# Altium schematic sheet CSP.SchDoc
size A4
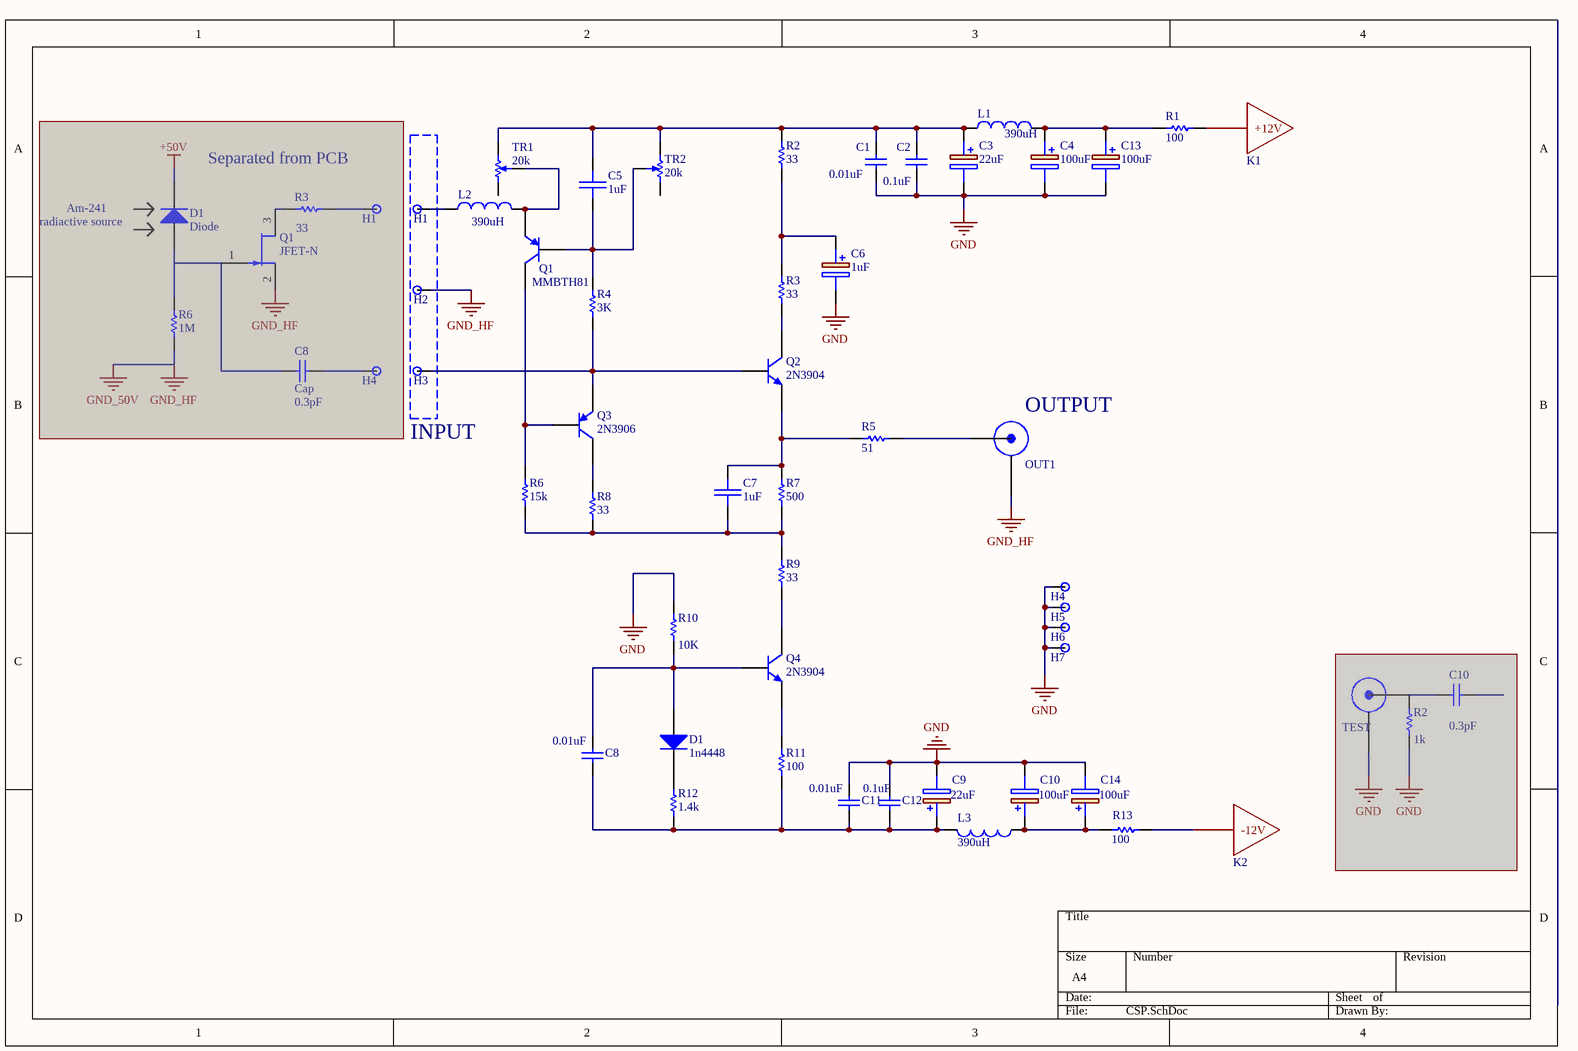
[diagram p0: CSP.SchDoc]

## Parts
(Parts that share a designator on the sheet are numbered #1, #2 ... from top to bottom, then left to right.)
C1  0.01uF  [SMD-0805-C]
C2  0.1uF  [SMD-0805-C]
C3  22uF  [CAPAE660X550N]
C4  100uF  [CAPAE660X800N]
C5  1uF  [CAPC3225X15L]
C6  1uF  [CAPAE430X550N]
C7  1uF  [CAPC3225X15L]
C8#1  Cap  value 0.3pF  [0603]  (masked out: inside a compile mask, not in the netlist)
C8#2  0.01uF  [SMD-0805-C]
C9  22uF  [CAPAE660X550N]
C10#1  value 0.3pF  [0603]  (hidden comment: Cap)  (masked out: inside a compile mask, not in the netlist)
C10#2  100uF  [CAPAE660X800N]
C11  0.01uF  [SMD-0805-C]
C12  0.1uF  [SMD-0805-C]
C13  100uF  [CAPAE660X800N]
C14  100uF  [CAPAE660X800N]
D1#1  Diode  [SMC]  (masked out: inside a compile mask, not in the netlist)
D1#2  1n4448  [SODFL350X110-2N]
H1#1  PAD  [PAD]  (value not drawn)  (no BOM)  (masked out: inside a compile mask, not in the netlist)
H1#2  PAD  [PAD]  (value not drawn)  (no BOM)
H2  PAD  [PAD]  (value not drawn)  (no BOM)
H3  PAD  [PAD]  (value not drawn)  (no BOM)
H4#1  PAD  [PAD]  (value not drawn)  (no BOM)  (masked out: inside a compile mask, not in the netlist)
H4#2  PAD  [PAD]  (value not drawn)  (no BOM)
H5  PAD  [PAD]  (value not drawn)  (no BOM)
H6  PAD  [PAD]  (value not drawn)  (no BOM)
H7  PAD  [PAD]  (value not drawn)  (no BOM)
K1  +12V  [PAD]  (value not drawn)  (no BOM)
K2  -12V  [PAD]  (value not drawn)  (no BOM)
L1  390uH  [INDC3225X270N]
L2  390uH  [INDC3225X270N]
L3  390uH  [INDC3225X270N]
OUT1  OUTPUT  [IN/OUT]  (value not drawn)  (no BOM)
Q1#1  JFET-N  [SOT23_M]  (masked out: inside a compile mask, not in the netlist)
Q1#2  MMBTH81  [SOT23-3P95_240X110L53X44N]
Q2  2N3904  [SOT23-3P95_240X110L53X44N]
Q3  2N3906  [SOT23-3P95_240X110L53X44N]
Q4  2N3904  [SOT23-3P95_240X110L53X44N]
R1  100  [SMD-0805-RES]
R2#1  33  [SMD-0805-RES]
R2#2  value 1k  [SMD-0805-RES]  (hidden comment: Res1)  (masked out: inside a compile mask, not in the netlist)
R3#1  value 33  [SMD-0805-RES]  (masked out: inside a compile mask, not in the netlist)
R3#2  33  [SMD-0805-RES]
R4  3K  [SMD-0805-RES]
R5  51  [SMD-0805-RES]
R6#1  value 1M  [SMD-0805-RES]  (masked out: inside a compile mask, not in the netlist)
R6#2  15k  [SMD-0805-RES]
R7  500  [SMD-0805-RES]
R8  33  [SMD-0805-RES]
R9  33  [SMD-0805-RES]
R10  10K  [SMD-0805-RES]
R11  100  [SMD-0805-RES]
R12  1.4k  [SMD-0805-RES]
R13  100  [SMD-0805-RES]
TEST  INPUT  [IN/OUT]  (value not drawn)  (masked out: inside a compile mask, not in the netlist)
TR1  20k  [POT4MM-2]
TR2  20k  [POT4MM-2]

## Blocks framed on the sheet
Separated from PCB: C8#1 D1#1 H1#1 H4#1 Q1#1 R3#1 R6#1

## Nets
GND: C1.1 C2.1 C3.2(-) C4.2(-) C6.2(-) C9.2(-) C10#2.2(-) C11.1 C12.1 C13.2(-) C14.2(-) H4#2.1 H5.1 H6.1 H7.1 R10.2
GND_HF: H2.1 OUT1.2(GND)
NetC1_2: C1.2 C2.2 C3.1(+) C5.2(-) L1.1 R2#1.2 TR1.CW(+) TR2.CCW(-)
NetC4_1: C4.1(+) C13.1(+) L1.2 R1.2
NetC5_1: C5.1(+) Q1#2.3(B) R4.2 TR2.W
NetC6_1: C6.1(+) R2#1.1 R3#2.2
NetC7_1: C7.1(+) R6#2.1 R7.1 R8.1 R9.2
NetC7_2: C7.2(-) Q2.2(E) R5.2 R7.2
NetC8#2_1: C8#2.1 D1#2.A Q4.3(B) R10.1
NetC8#2_2: C8#2.2 C9.1(+) C11.2 C12.2 L3.2 R11.1 R12.1
NetC10#2_1: C10#2.1(+) C14.1(+) L3.1 R13.2
NetD1#2_C: D1#2.C R12.2
NetH1#2_1: H1#2.1 L2.1
NetH3_1: H3.1 Q2.3(B) Q3.2(E) R4.1
NetK1_1: K1.1(+12V) R1.1
NetK2_1: K2.1(-12V) R13.1
NetL2_2: L2.2 Q1#2.2(E) TR1.W
NetOUT1_1: OUT1.1(IN) R5.1
NetQ1#2_1: Q1#2.1(C) Q3.3(B) R6#2.2
NetQ2_1: Q2.1(C) R3#2.1
NetQ3_1: Q3.1(C) R8.2
NetQ4_1: Q4.1(C) R9.1
NetQ4_2: Q4.2(E) R11.2

Not connected (* = marked no-connect by the designer): TR1 CCW(-); TR2 CW(+)

## Notes on the sheet
- (near D1#1) radiactive source
- Am-241
- INPUT
- (near OUT1) OUTPUT

## Library data of the parts
C1 C2 C8#1 C8#2 C10#1 C11 C12 = Cap: Capacitor; Published: 8-Jun-2000; LatestRevisionDate: 17-Jul-2002; LatestRevisionNote: Re-released for DXP Platform.; PackageReference: RAD-0.3; Publisher: Altium Limited; PackageDescription: Radial Cap, Thru-Hole; 2 Leads; 0.3 in Pin Spacing
  C1 C8#2 C11: Value: 0.01uF; LCSC Part #: C1710
  C2 C12: Value: 0.1uF; LCSC Part #: C49678
C3 C9 = TYEH1V226F55MTR: 22uF 35V, Capacitor Polarised; Part number: TYEH1V226F55MTR; Value: 22uF; Dimension: 6.3x5.3mm; Voltage: 35V; LCSC Part #: C249771
C4 C10#2 C13 C14 = EEEFK1E101P: 100uF 25V, cap polarised; Part number: EEEFK1E101P; Dimensions: 8x6.2mm; Voltage: 25V; Value: 100uF; LCSC Part #: C249983
C5 C7 = capacitor: Value: 1uF; LCSC Part #: C117027
C6 = UWT1H010MCL1GB: 1uF 50V, Capacitor Polarised; Manufacturer_Name: Nichicon; Part number: UWT1H010MCL1GB; Dimensions: 4x5.4mm; Value: 1uF; Voltage: 50V; LCSC Part #: *
D1#1 = Diode: Default Diode; Published: 8-Jun-2000; LatestRevisionDate: 17-Jul-2002; LatestRevisionNote: Re-released for DXP Platform.; PackageVersion: Sep-1996; PackageReference: SMC; Publisher: Altium Limited; PackageDescription: DO-214-AB/SMC; 2 C-Bend Leads; Body 7.9 x 5.9 mm, inc. leads (LxW); Code_JEDEC: DO-214-AB
D1#2 = Diode: SOD123, 1n4446 orginally; Value: 1n4448; LCSC Part #: C108428
L1-L3 = NLV10JT391: 390uH, Inductor, LCSC part is 330uH1!!!; Resistance: 36; Value: 390uH; Package: 1210; LCSC Part #: C87557
Q1#1 = JFET-N: N-Channel JFET; Published: 8-Jun-2000; LatestRevisionDate: 17-Jul-2002; LatestRevisionNote: Re-released for DXP Platform.; PackageReference: TO-254-AA; Publisher: Altium Limited; Code_JEDEC: TO-254-AA
Q1#2 = PNP: PNP Bipolar Transistor, Aternatives: NTE2403; Published: 8-Jun-2000; LatestRevisionDate: 29-May-2009; LatestRevisionNote: IPC-7351 Footprint Added.; PackageVersion: Aug-1999; PackageReference: SOT-23B; Publisher: Altium Limited; PackageDescription: 3-Pin SOT-23 Package 0.95 mm Pitch, 2.4 mm Lead Span; Supplier 1: Arrow; Supplier Part Number 1: MMBTH81; Supplier 2: Digi-Key; Supplier Part Number 2: KST10MTFCT-ND; Value: MMBTH81; LCSC Part #: C190349
Q2 Q4 = NPN: NPN Bipolar Transistor; Published: 8-Jun-2000; LatestRevisionDate: 17-Jul-2002; LatestRevisionNote: Re-released for DXP Platform.; PackageReference: TO-226-AA; Publisher: Altium Limited; PackageDescription: TO, Flat Index; 3 In-Line, Axial Leads; Body Dia. 4.8mm; Leads 0.55 x 0.51 mm (max); Code_JEDEC: TO-226-AA; Value: 2N3904; LCSC Part #: C18536
Q3 = PNP: PNP Bipolar Transistor; Published: 8-Jun-2000; LatestRevisionDate: 29-May-2009; LatestRevisionNote: IPC-7351 Footprint Added.; PackageVersion: Aug-1999; PackageReference: SOT-23B; Publisher: Altium Limited; PackageDescription: 3-Pin SOT-23 Package 0.95 mm Pitch, 2.4 mm Lead Span; Value: 2N3906; LCSC Part #: C14488
R1 R2#1 R2#2 R3#1 R3#2 R4 R5 R6#1 R6#2 R7-R13 = Res1: Resistor; Published: 8-Jun-2000; LatestRevisionDate: 17-Jul-2002; LatestRevisionNote: Re-released for DXP Platform.; PackageReference: AXIAL-0.3; Publisher: Altium Limited; PackageDescription: Axial Device, Thru-Hole; 2 Leads; 0.3 in Pin Spacing
  R1 R11 R13: Value: 100; LCSC Part #: C17408
  R2#1 R3#2 R8 R9: Value: 33; LCSC Part #: C17634
  R4: Value: 3K; LCSC Part #: C17661
  R5: Value: 51; LCSC Part #: C17738
  R6#2: Value: 15k; LCSC Part #: C17475
  R7: Value: 500; LCSC Part #: C17734
  R10: Value: 10K; LCSC Part #: C17414
  R12: Value: 1.4k; LCSC Part #: C17388
TR1 TR2 = RPot SM: Square Trimming Potentiometer; Published: 17-Dec-2003; DatasheetVersion: Oct-2003; PackageReference: POT4MM-2; Publisher: Altium Limited; PackageDescription: Square Trimming Potentiometer; ComponentLink1Description: Manufacturer Link; ComponentLink1URL: http://bourns.com/2/search.html; Value: 20k; LCSC Part #: *